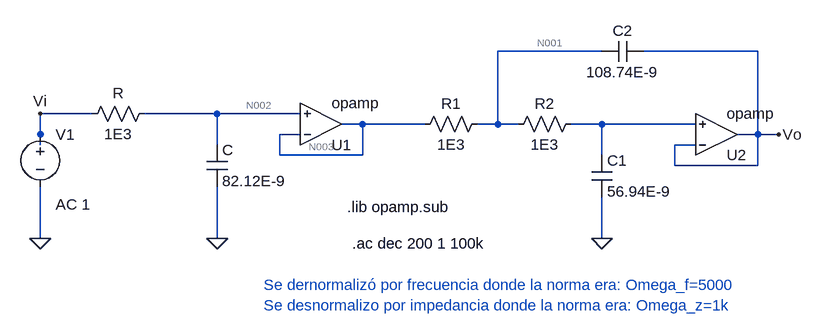
[diagram p0: schematic desnormalizado_bonus.asc]
desnormalizado_bonus.asc, the LTspice schematic file:
Version 4.1
SHEET 1 976 680
WIRE 656 64 496 64
WIRE 896 64 720 64
WIRE -128 160 -208 160
WIRE 64 160 -48 160
WIRE 192 160 64 160
WIRE 288 176 256 176
WIRE 384 176 288 176
WIRE 496 176 496 64
WIRE 496 176 464 176
WIRE 528 176 496 176
WIRE 656 176 608 176
WIRE 800 176 656 176
WIRE -208 192 -208 160
WIRE 192 192 160 192
WIRE 896 192 896 64
WIRE 896 192 864 192
WIRE 928 192 896 192
WIRE -208 208 -208 192
WIRE 64 208 64 160
WIRE 800 208 768 208
WIRE 160 224 160 192
WIRE 288 224 288 176
WIRE 288 224 160 224
WIRE 656 224 656 176
WIRE 768 240 768 208
WIRE 896 240 896 192
WIRE 896 240 768 240
WIRE -208 352 -208 272
WIRE 64 352 64 272
WIRE 656 352 656 288
FLAG -208 352 0
FLAG 64 352 0
FLAG 656 352 0
FLAG -208 160 Vi
FLAG 928 192 Vo
SYMBOL res -32 144 R90
WINDOW 0 0 56 VBottom 2
WINDOW 3 32 56 VTop 2
SYMATTR InstName R
SYMATTR Value 1E3
SYMBOL cap 48 208 R0
SYMATTR InstName C
SYMATTR Value 82.12E-9
SYMBOL res 480 160 R90
WINDOW 0 0 56 VBottom 2
WINDOW 3 32 56 VTop 2
SYMATTR InstName R1
SYMATTR Value 1E3
SYMBOL res 624 160 R90
WINDOW 0 0 56 VBottom 2
WINDOW 3 32 56 VTop 2
SYMATTR InstName R2
SYMATTR Value 1E3
SYMBOL cap 640 224 R0
SYMATTR InstName C1
SYMATTR Value 56.94E-9
SYMBOL cap 720 48 R90
WINDOW 0 0 32 VBottom 2
WINDOW 3 32 32 VTop 2
SYMATTR InstName C2
SYMATTR Value 108.74E-9
SYMBOL OpAmps\\opamp 224 240 M180
SYMATTR InstName U1
SYMBOL OpAmps\\opamp 832 256 M180
SYMATTR InstName U2
SYMBOL voltage -208 176 R0
WINDOW 123 24 124 Left 2
WINDOW 39 0 0 Left 0
SYMATTR InstName V1
SYMATTR Value ""
SYMATTR Value2 AC 1
TEXT 264 304 Left 2 !.lib opamp.sub
TEXT 272 360 Left 2 !.ac dec 200 1 100k
TEXT 136 424 Left 2 ;Se dernormalizó por frecuencia donde la norma era: Omega_f=5000\nSe desnormalizo por impedancia donde la norma era: Omega_z=1k

The netlist it stands for:
* desnormalizado_bonus.asc
R N002 Vi 1E3
C N002 0 82.12E-9
R1 N001 N003 1E3
R2 N004 N001 1E3
C1 N004 0 56.94E-9
C2 Vo N001 108.74E-9
X§U1 N003 N002 N003 opamp Aol=100K GBW=10Meg  ; pins invin noninvin out
X§U2 Vo N004 Vo opamp Aol=100K GBW=10Meg  ; pins invin noninvin out
V1 Vi 0 AC 1
.lib opamp.sub
.ac dec 200 1 100k
* Se dernormalizó por frecuencia donde la norma era: Omega_f=5000
* Se desnormalizo por impedancia donde la norma era: Omega_z=1k
.backanno
.end

* Results of the author's LTspice run, read from the files saved beside the schematic
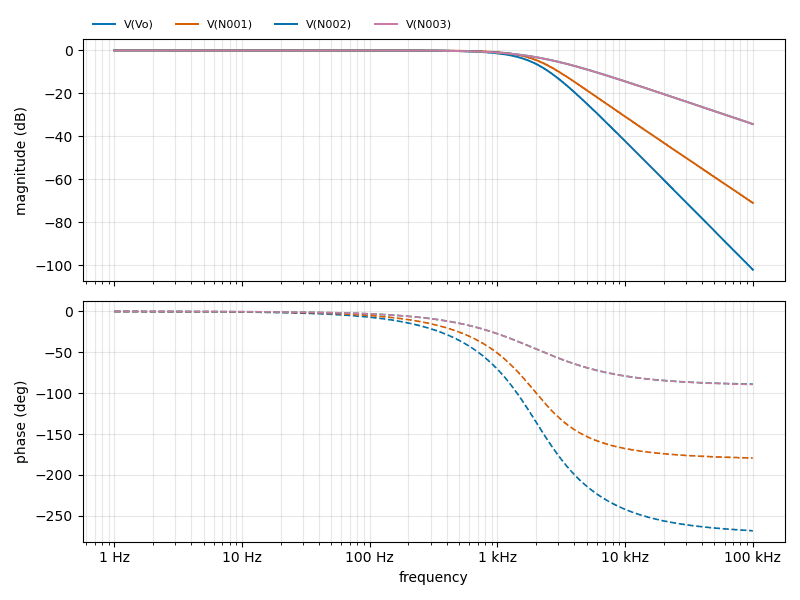
[diagram p1: AC Analysis of desnormalizado_bonus.asc, plotted from the saved traces]
* AC Analysis, 1 run:
*   V(Vo): -0.00 dB at 1 Hz, -102.02 dB at 100 kHz, peak -0.00 dB at 1 Hz, 3 dB below the peak at 1.429 kHz
*   V(N001): -0.00 dB at 1 Hz, -70.95 dB at 100 kHz, peak -0.00 dB at 1 Hz, 3 dB below the peak at 1.689 kHz
*   V(N002): -0.00 dB at 1 Hz, -34.25 dB at 100 kHz, peak -0.00 dB at 1 Hz, 3 dB below the peak at 1.938 kHz
*   V(N003): -0.00 dB at 1 Hz, -34.25 dB at 100 kHz, peak -0.00 dB at 1 Hz, 3 dB below the peak at 1.938 kHz